# EAGLE design cd4051 (EAGLE 7.5.0)
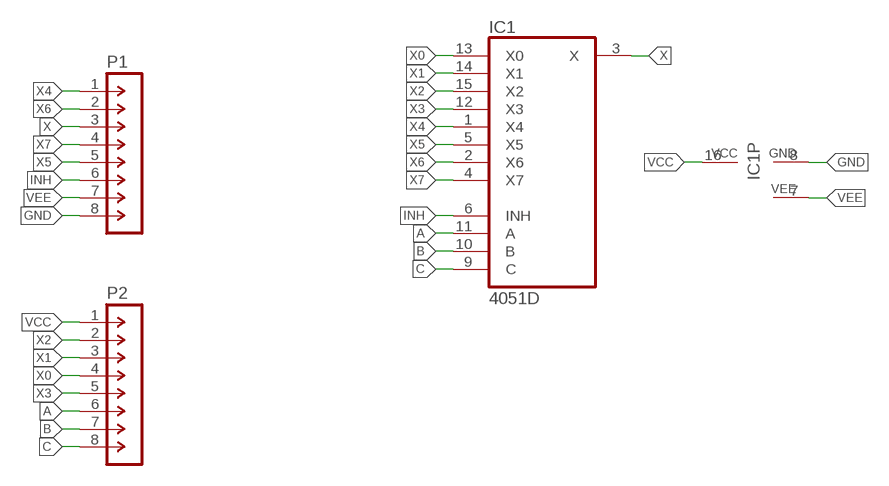
[diagram p0: schematic, sheet 1]

## Parts
IC1  4051D  [SO16]
P1  M-1X08-SIP-100-32Y  [SIP-100-08-32Y]
P2  M-1X08-SIP-100-32Y  [SIP-100-08-32Y]

## Nets
A: IC1.11(A) P2.6
B: IC1.10(B) P2.7
C: IC1.9(C) P2.8
GND: IC1.8(GND) P1.8
INH: IC1.6(INH) P1.6
VCC: IC1.16(VCC) P2.1
VEE: IC1.7(VEE) P1.7
X: IC1.3(X) P1.3
X0: IC1.13(X0) P2.4
X1: IC1.14(X1) P2.3
X2: IC1.15(X2) P2.2
X3: IC1.12(X3) P2.5
X4: IC1.1(X4) P1.1
X5: IC1.5(X5) P1.5
X6: IC1.2(X6) P1.2
X7: IC1.4(X7) P1.4

## Library data of the parts
IC1 = 40xx:4051: 8-channel ANALOG MULTIPLEXER
P1 P2 = con-headers-jp:M-1X08-: MALE HEADER

## Board
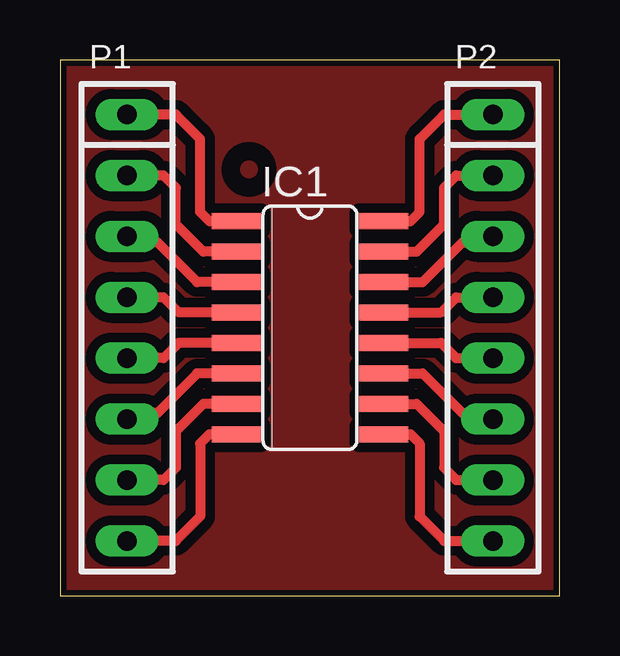
[diagram p1: board, top side]

Size 20.83 x 22.34 mm. Coordinates in mm from the lower left corner, seen from the top.
Outline: 0,0 20.83,0 20.83,22.34 0,22.34 0,0
Copper layers (1*16): Top 0.035mm / dielectric 1.5mm / Bottom 0.035mm
Design rules "default 16mils": minimum track width 10mil, minimum drill 24mil, track to track 16mil, track to pad 16mil, pad to pad 16mil, via to via 16mil, smd to smd 10mil, copper to edge 10mil, drill to drill 10mil, minimum pad ring 10mil, minimum via ring 8mil, stop-mask expansion 4mil, vias tented up to drill 0mil, thermal gap 12mil
tRestrict: area 7.1,17 to 8.6,18.5

### Footprints (pad centres in the part's own frame; a part is rotated, then mirrored left to right if it is on the bottom)
SO16 = smd 0.66 x 2.032: 1 -4.445,-3.073; 2 -3.175,-3.073; 3 -1.905,-3.073; 4 -0.635,-3.073; 5 0.635,-3.073; 6 1.905,-3.073; 7 3.175,-3.073; 8 4.445,-3.073; 9 4.445,3.073; 10 3.175,3.073; 11 1.905,3.073; 12 0.635,3.073; 13 -0.635,3.073; 14 -1.905,3.073; 15 -3.175,3.073; 16 -4.445,3.073
SIP-100-08-32Y = drill 0.813 long: 1 -8.89,0; 2 -6.35,0; 3 -3.81,0; 4 -1.27,0; 5 1.27,0; 6 3.81,0; 7 6.35,0; 8 8.89,0

### Placement (x,y rotation side)
IC1  10.41,11.18 270 top
P1  2.79,11.18 270 top
P2  18.03,11.18 270 top

### Tracks (layer width: path | path; a pad name or v marks a point on that pad's centre or on a via)
A
  Top 0.406: IC1.11 15.11,9.27 16.76,7.62 17.78,7.62 P2.6
B
  Top 0.406: IC1.10 14.86,8 16,6.86 16,5.33 16.51,4.83 P2.7
C
  Top 0.406: IC1.9 14.61,6.73 14.99,6.35 14.99,3.3 16,2.29 P2.8
GND
  Top 0.406: IC1.8 6.22,6.73 5.84,6.35 5.84,3.3 4.83,2.29 P1.8
INH
  Top 0.406: IC1.6 5.71,9.27 4.06,7.62 3.05,7.62 P1.6
N$1
  pour Top: 0,22.35 20.83,22.35 20.83,0 0,0
VCC
  Top 0.406: IC1.16 14.61,15.62 14.99,16 14.99,19.05 16,20.07 P2.1
VEE
  Top 0.406: IC1.7 5.97,8 4.83,6.86 4.83,5.33 4.32,4.83 P1.7
X
  Top 0.406: IC1.3 5.71,13.08 4.06,14.73 3.05,14.73 P1.3
X0
  Top 0.406: IC1.13 15.88,11.81 16.51,12.45 P2.4
X1
  Top 0.406: IC1.14 15.11,13.08 16.76,14.73 17.78,14.73 P2.3
X2
  Top 0.406: IC1.15 14.86,14.35 16,15.49 16,17.02 16.51,17.53 P2.2
X3
  Top 0.406: IC1.12 15.88,10.54 16.51,9.91 P2.5
X4
  Top 0.406: IC1.1 6.22,15.62 5.84,16 5.84,19.05 4.83,20.07 P1.1
X5
  Top 0.406: IC1.5 4.95,10.54 4.32,9.91 P1.5
X6
  Top 0.406: IC1.2 5.97,14.35 4.83,15.49 4.83,17.02 4.32,17.53 P1.2
X7
  Top 0.406: IC1.4 4.95,11.81 4.32,12.45 P1.4